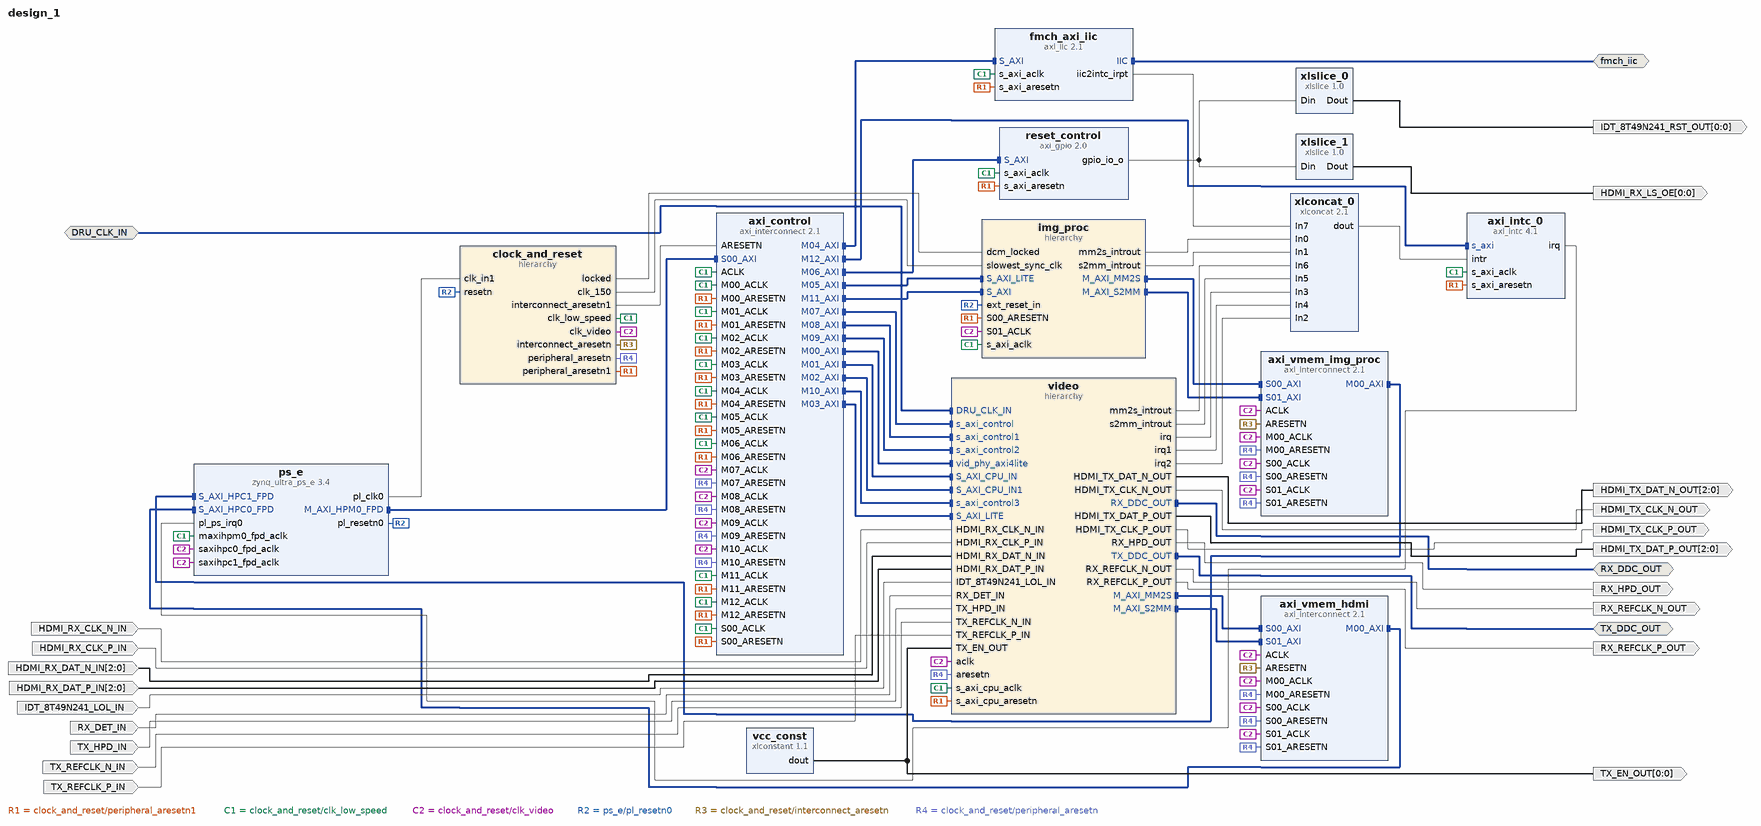
[diagram p0: block diagram of the top level]
# Vivado block design design_1, xczu7ev-ffvc1156-2-e, Vivado 2022.2
create_bd_design design_1

create_bd_intf_port -mode Slave -vlnv xilinx.com:interface:diff_clock_rtl:1.0 DRU_CLK_IN
set_property -dict {CONFIG.FREQ_HZ 156250000} [get_bd_intf_ports DRU_CLK_IN]
create_bd_intf_port -mode Master -vlnv xilinx.com:interface:iic_rtl:1.0 RX_DDC_OUT
create_bd_intf_port -mode Master -vlnv xilinx.com:interface:iic_rtl:1.0 TX_DDC_OUT
create_bd_intf_port -mode Master -vlnv xilinx.com:interface:iic_rtl:1.0 fmch_iic
create_bd_port -dir I HDMI_RX_CLK_N_IN
create_bd_port -dir I HDMI_RX_CLK_P_IN
create_bd_port -dir I -from 2 -to 0 HDMI_RX_DAT_N_IN
create_bd_port -dir I -from 2 -to 0 HDMI_RX_DAT_P_IN
create_bd_port -dir O -from 0 -to 0 HDMI_RX_LS_OE
create_bd_port -dir O HDMI_TX_CLK_N_OUT
create_bd_port -dir O HDMI_TX_CLK_P_OUT
create_bd_port -dir O -from 2 -to 0 HDMI_TX_DAT_N_OUT
create_bd_port -dir O -from 2 -to 0 HDMI_TX_DAT_P_OUT
create_bd_port -dir I IDT_8T49N241_LOL_IN
create_bd_port -dir O -from 0 -to 0 IDT_8T49N241_RST_OUT
create_bd_port -dir I RX_DET_IN
create_bd_port -dir O RX_HPD_OUT
create_bd_port -dir O RX_REFCLK_N_OUT
create_bd_port -dir O RX_REFCLK_P_OUT
create_bd_port -dir O -from 0 -to 0 TX_EN_OUT
create_bd_port -dir I TX_HPD_IN
create_bd_port -dir I TX_REFCLK_N_IN
create_bd_port -dir I TX_REFCLK_P_IN

create_bd_cell -type ip -vlnv xilinx.com:ip:axi_intc:4.1 axi_intc_0
set_property -dict [list \
  CONFIG.C_ASYNC_INTR 0xFFFFFFFF \
  CONFIG.C_CASCADE_MASTER 0 \
  CONFIG.C_DISABLE_SYNCHRONIZERS 0 \
  CONFIG.C_ENABLE_ASYNC 0 \
  CONFIG.C_EN_CASCADE_MODE 0 \
  CONFIG.C_HAS_CIE 1 \
  CONFIG.C_HAS_FAST 0 \
  CONFIG.C_HAS_ILR 0 \
  CONFIG.C_HAS_IPR 1 \
  CONFIG.C_HAS_IVR 1 \
  CONFIG.C_HAS_SIE 1 \
  CONFIG.C_IRQ_ACTIVE 0x1 \
  CONFIG.C_IRQ_CONNECTION 1 \
  CONFIG.C_IRQ_IS_LEVEL 1 \
  CONFIG.C_KIND_OF_EDGE 0xFFFFFFFF \
  CONFIG.C_KIND_OF_INTR 0xFFFFFFFF \
  CONFIG.C_KIND_OF_LVL 0xFFFFFFFF \
  CONFIG.C_MB_CLK_NOT_CONNECTED 1 \
  CONFIG.C_NUM_SW_INTR 0 \
  CONFIG.C_NUM_SYNC_FF 2 \
  CONFIG.C_PROCESSOR_CLK_FREQ_MHZ 100.0 \
  CONFIG.C_S_AXI_ACLK_FREQ_MHZ 75.0 \
  CONFIG.Sense_of_IRQ_Edge_Type Rising \
  CONFIG.Sense_of_IRQ_Level_Type Active_High \
] [get_bd_cells axi_intc_0]
create_bd_cell -type ip -vlnv xilinx.com:ip:zynq_ultra_ps_e:3.4 ps_e
set_property -dict [list \
  CONFIG.CAN0_BOARD_INTERFACE custom \
  CONFIG.CAN1_BOARD_INTERFACE custom \
  CONFIG.CSU_BOARD_INTERFACE custom \
  CONFIG.DP_BOARD_INTERFACE custom \
  CONFIG.GEM0_BOARD_INTERFACE custom \
  CONFIG.GEM1_BOARD_INTERFACE custom \
  CONFIG.GEM2_BOARD_INTERFACE custom \
  CONFIG.GEM3_BOARD_INTERFACE custom \
  CONFIG.GPIO_BOARD_INTERFACE custom \
  CONFIG.IIC0_BOARD_INTERFACE custom \
  CONFIG.IIC1_BOARD_INTERFACE custom \
  CONFIG.NAND_BOARD_INTERFACE custom \
  CONFIG.PCIE_BOARD_INTERFACE custom \
  CONFIG.PJTAG_BOARD_INTERFACE custom \
  CONFIG.PMU_BOARD_INTERFACE custom \
  CONFIG.PSU_BANK_0_IO_STANDARD LVCMOS18 \
  CONFIG.PSU_BANK_1_IO_STANDARD LVCMOS18 \
  CONFIG.PSU_BANK_2_IO_STANDARD LVCMOS18 \
  CONFIG.PSU_BANK_3_IO_STANDARD LVCMOS33 \
  CONFIG.PSU_USB3__DUAL_CLOCK_ENABLE 1 \
  CONFIG.PSU__CAN1__PERIPHERAL__ENABLE 1 \
  CONFIG.PSU__CAN1__PERIPHERAL__IO {MIO 24 .. 25} \
  CONFIG.PSU__CRF_APB__ACPU_CTRL__FREQMHZ 1200 \
  CONFIG.PSU__CRF_APB__ACPU_CTRL__SRCSEL APLL \
  CONFIG.PSU__CRF_APB__APLL_CTRL__SRCSEL PSS_REF_CLK \
  CONFIG.PSU__CRF_APB__DBG_FPD_CTRL__FREQMHZ 250 \
  CONFIG.PSU__CRF_APB__DBG_FPD_CTRL__SRCSEL IOPLL \
  CONFIG.PSU__CRF_APB__DBG_TRACE_CTRL__FREQMHZ 250 \
  CONFIG.PSU__CRF_APB__DBG_TRACE_CTRL__SRCSEL IOPLL \
  CONFIG.PSU__CRF_APB__DBG_TSTMP_CTRL__FREQMHZ 250 \
  CONFIG.PSU__CRF_APB__DBG_TSTMP_CTRL__SRCSEL IOPLL \
  CONFIG.PSU__CRF_APB__DDR_CTRL__FREQMHZ 1067 \
  CONFIG.PSU__CRF_APB__DDR_CTRL__SRCSEL DPLL \
  CONFIG.PSU__CRF_APB__DPDMA_REF_CTRL__FREQMHZ 600 \
  CONFIG.PSU__CRF_APB__DPDMA_REF_CTRL__SRCSEL APLL \
  CONFIG.PSU__CRF_APB__DPLL_CTRL__SRCSEL PSS_REF_CLK \
  CONFIG.PSU__CRF_APB__DP_AUDIO_REF_CTRL__SRCSEL RPLL \
  CONFIG.PSU__CRF_APB__DP_STC_REF_CTRL__SRCSEL RPLL \
  CONFIG.PSU__CRF_APB__DP_VIDEO_REF_CTRL__SRCSEL VPLL \
  CONFIG.PSU__CRF_APB__GDMA_REF_CTRL__FREQMHZ 600 \
  CONFIG.PSU__CRF_APB__GDMA_REF_CTRL__SRCSEL APLL \
  CONFIG.PSU__CRF_APB__GPU_REF_CTRL__FREQMHZ 500 \
  CONFIG.PSU__CRF_APB__GPU_REF_CTRL__SRCSEL IOPLL \
  CONFIG.PSU__CRF_APB__TOPSW_LSBUS_CTRL__FREQMHZ 100 \
  CONFIG.PSU__CRF_APB__TOPSW_LSBUS_CTRL__SRCSEL IOPLL \
  CONFIG.PSU__CRF_APB__TOPSW_MAIN_CTRL__FREQMHZ 533.33 \
  CONFIG.PSU__CRF_APB__TOPSW_MAIN_CTRL__SRCSEL DPLL \
  CONFIG.PSU__CRF_APB__VPLL_CTRL__SRCSEL PSS_REF_CLK \
  CONFIG.PSU__CRL_APB__ADMA_REF_CTRL__FREQMHZ 500 \
  CONFIG.PSU__CRL_APB__ADMA_REF_CTRL__SRCSEL IOPLL \
  CONFIG.PSU__CRL_APB__CAN1_REF_CTRL__FREQMHZ 100 \
  CONFIG.PSU__CRL_APB__CAN1_REF_CTRL__SRCSEL IOPLL \
  CONFIG.PSU__CRL_APB__CPU_R5_CTRL__FREQMHZ 500 \
  CONFIG.PSU__CRL_APB__CPU_R5_CTRL__SRCSEL IOPLL \
  CONFIG.PSU__CRL_APB__DBG_LPD_CTRL__FREQMHZ 250 \
  CONFIG.PSU__CRL_APB__DBG_LPD_CTRL__SRCSEL IOPLL \
  CONFIG.PSU__CRL_APB__GEM3_REF_CTRL__FREQMHZ 125 \
  CONFIG.PSU__CRL_APB__GEM3_REF_CTRL__SRCSEL IOPLL \
  CONFIG.PSU__CRL_APB__I2C0_REF_CTRL__FREQMHZ 100 \
  CONFIG.PSU__CRL_APB__I2C0_REF_CTRL__SRCSEL IOPLL \
  CONFIG.PSU__CRL_APB__I2C1_REF_CTRL__FREQMHZ 100 \
  CONFIG.PSU__CRL_APB__I2C1_REF_CTRL__SRCSEL IOPLL \
  CONFIG.PSU__CRL_APB__IOPLL_CTRL__SRCSEL PSS_REF_CLK \
  CONFIG.PSU__CRL_APB__IOU_SWITCH_CTRL__FREQMHZ 250 \
  CONFIG.PSU__CRL_APB__IOU_SWITCH_CTRL__SRCSEL IOPLL \
  CONFIG.PSU__CRL_APB__LPD_LSBUS_CTRL__FREQMHZ 100 \
  CONFIG.PSU__CRL_APB__LPD_LSBUS_CTRL__SRCSEL IOPLL \
  CONFIG.PSU__CRL_APB__LPD_SWITCH_CTRL__FREQMHZ 500 \
  CONFIG.PSU__CRL_APB__LPD_SWITCH_CTRL__SRCSEL IOPLL \
  CONFIG.PSU__CRL_APB__PCAP_CTRL__FREQMHZ 200 \
  CONFIG.PSU__CRL_APB__PCAP_CTRL__SRCSEL IOPLL \
  CONFIG.PSU__CRL_APB__PL0_REF_CTRL__FREQMHZ 100 \
  CONFIG.PSU__CRL_APB__PL0_REF_CTRL__SRCSEL IOPLL \
  CONFIG.PSU__CRL_APB__QSPI_REF_CTRL__FREQMHZ 125 \
  CONFIG.PSU__CRL_APB__QSPI_REF_CTRL__SRCSEL IOPLL \
  CONFIG.PSU__CRL_APB__RPLL_CTRL__SRCSEL PSS_REF_CLK \
  CONFIG.PSU__CRL_APB__SDIO1_REF_CTRL__FREQMHZ 200 \
  CONFIG.PSU__CRL_APB__SDIO1_REF_CTRL__SRCSEL IOPLL \
  CONFIG.PSU__CRL_APB__TIMESTAMP_REF_CTRL__FREQMHZ 100 \
  CONFIG.PSU__CRL_APB__TIMESTAMP_REF_CTRL__SRCSEL IOPLL \
  CONFIG.PSU__CRL_APB__UART0_REF_CTRL__FREQMHZ 100 \
  CONFIG.PSU__CRL_APB__UART0_REF_CTRL__SRCSEL IOPLL \
  CONFIG.PSU__CRL_APB__UART1_REF_CTRL__FREQMHZ 100 \
  CONFIG.PSU__CRL_APB__UART1_REF_CTRL__SRCSEL IOPLL \
  CONFIG.PSU__CRL_APB__USB0_BUS_REF_CTRL__FREQMHZ 250 \
  CONFIG.PSU__CRL_APB__USB0_BUS_REF_CTRL__SRCSEL IOPLL \
  CONFIG.PSU__CRL_APB__USB3_DUAL_REF_CTRL__FREQMHZ 20 \
  CONFIG.PSU__CRL_APB__USB3_DUAL_REF_CTRL__SRCSEL IOPLL \
  CONFIG.PSU__CRL_APB__USB3__ENABLE 1 \
  CONFIG.PSU__CSUPMU__PERIPHERAL__VALID 0 \
  CONFIG.PSU__DDRC__BUS_WIDTH {64 Bit} \
  CONFIG.PSU__DDRC__COMPONENTS Components \
  CONFIG.PSU__DDRC__DEVICE_CAPACITY {4096 MBits} \
  CONFIG.PSU__DDRC__DRAM_WIDTH {16 Bits} \
  CONFIG.PSU__DDRC__ECC Disabled \
  CONFIG.PSU__DDRC__MEMORY_TYPE {DDR 4} \
  CONFIG.PSU__DDRC__SPEED_BIN DDR4_2133P \
  CONFIG.PSU__DDR_HIGH_ADDRESS_GUI_ENABLE 0 \
  CONFIG.PSU__DDR__INTERFACE__FREQMHZ 533.500 \
  CONFIG.PSU__DEVICE_TYPE EV \
  CONFIG.PSU__DISPLAYPORT__LANE0__ENABLE 1 \
  CONFIG.PSU__DISPLAYPORT__LANE0__IO {GT Lane1} \
  CONFIG.PSU__DISPLAYPORT__LANE1__ENABLE 1 \
  CONFIG.PSU__DISPLAYPORT__LANE1__IO {GT Lane0} \
  CONFIG.PSU__DISPLAYPORT__PERIPHERAL__ENABLE 1 \
  CONFIG.PSU__DLL__ISUSED 1 \
  CONFIG.PSU__DPAUX__PERIPHERAL__ENABLE 1 \
  CONFIG.PSU__DPAUX__PERIPHERAL__IO {MIO 27 .. 30} \
  CONFIG.PSU__DP__LANE_SEL {Dual Lower} \
  CONFIG.PSU__DP__REF_CLK_FREQ 27 \
  CONFIG.PSU__DP__REF_CLK_SEL {Ref Clk3} \
  CONFIG.PSU__ENET3__FIFO__ENABLE 0 \
  CONFIG.PSU__ENET3__GRP_MDIO__ENABLE 1 \
  CONFIG.PSU__ENET3__GRP_MDIO__IO {MIO 76 .. 77} \
  CONFIG.PSU__ENET3__PERIPHERAL__ENABLE 1 \
  CONFIG.PSU__ENET3__PERIPHERAL__IO {MIO 64 .. 75} \
  CONFIG.PSU__ENET3__PTP__ENABLE 0 \
  CONFIG.PSU__ENET3__TSU__ENABLE 0 \
  CONFIG.PSU__FPGA_PL0_ENABLE 1 \
  CONFIG.PSU__GEM3_COHERENCY 0 \
  CONFIG.PSU__GEM3_ROUTE_THROUGH_FPD 0 \
  CONFIG.PSU__GEM__TSU__ENABLE 0 \
  CONFIG.PSU__GPIO0_MIO__PERIPHERAL__ENABLE 0 \
  CONFIG.PSU__GPIO1_MIO__PERIPHERAL__ENABLE 0 \
  CONFIG.PSU__GPIO_EMIO_WIDTH 95 \
  CONFIG.PSU__GT__LINK_SPEED HBR \
  CONFIG.PSU__GT__PRE_EMPH_LVL_4 0 \
  CONFIG.PSU__GT__VLT_SWNG_LVL_4 0 \
  CONFIG.PSU__I2C0__PERIPHERAL__ENABLE 0 \
  CONFIG.PSU__I2C1__PERIPHERAL__ENABLE 1 \
  CONFIG.PSU__I2C1__PERIPHERAL__IO {MIO 16 .. 17} \
  CONFIG.PSU__IOU_SLCR__IOU_TTC_APB_CLK__TTC0_SEL APB \
  CONFIG.PSU__IOU_SLCR__IOU_TTC_APB_CLK__TTC1_SEL APB \
  CONFIG.PSU__IOU_SLCR__IOU_TTC_APB_CLK__TTC2_SEL APB \
  CONFIG.PSU__IOU_SLCR__IOU_TTC_APB_CLK__TTC3_SEL APB \
  CONFIG.PSU__LPD_SLCR__CSUPMU__FREQMHZ 100 \
  CONFIG.PSU__MAXIGP0__DATA_WIDTH 32 \
  CONFIG.PSU__OVERRIDE_HPX_QOS 0 \
  CONFIG.PSU__OVERRIDE__BASIC_CLOCK 0 \
  CONFIG.PSU__PMU__GPO3__POLARITY {<Select>} \
  CONFIG.PSU__PMU__PERIPHERAL__ENABLE 0 \
  CONFIG.PSU__PRESET_APPLIED 1 \
  CONFIG.PSU__PSS_REF_CLK__FREQMHZ 33.333333 \
  CONFIG.PSU__QSPI_COHERENCY 0 \
  CONFIG.PSU__QSPI_ROUTE_THROUGH_FPD 0 \
  CONFIG.PSU__QSPI__GRP_FBCLK__ENABLE 1 \
  CONFIG.PSU__QSPI__GRP_FBCLK__IO {MIO 6} \
  CONFIG.PSU__QSPI__PERIPHERAL__DATA_MODE x4 \
  CONFIG.PSU__QSPI__PERIPHERAL__ENABLE 1 \
  CONFIG.PSU__QSPI__PERIPHERAL__IO {MIO 0 .. 5} \
  CONFIG.PSU__QSPI__PERIPHERAL__MODE Single \
  CONFIG.PSU__SATA__LANE1__IO {GT Lane3} \
  CONFIG.PSU__SATA__PERIPHERAL__ENABLE 1 \
  CONFIG.PSU__SATA__REF_CLK_FREQ 125 \
  CONFIG.PSU__SATA__REF_CLK_SEL {Ref Clk1} \
  CONFIG.PSU__SD0__CLK_100_SDR_OTAP_DLY 0x00 \
  CONFIG.PSU__SD0__CLK_200_SDR_OTAP_DLY 0x00 \
  CONFIG.PSU__SD0__CLK_50_DDR_ITAP_DLY 0x00 \
  CONFIG.PSU__SD0__CLK_50_DDR_OTAP_DLY 0x00 \
  CONFIG.PSU__SD0__CLK_50_SDR_ITAP_DLY 0x00 \
  CONFIG.PSU__SD0__CLK_50_SDR_OTAP_DLY 0x00 \
  CONFIG.PSU__SD1_COHERENCY 0 \
  CONFIG.PSU__SD1_ROUTE_THROUGH_FPD 0 \
  CONFIG.PSU__SD1__CLK_50_SDR_ITAP_DLY 0x15 \
  CONFIG.PSU__SD1__CLK_50_SDR_OTAP_DLY 0x5 \
  CONFIG.PSU__SD1__DATA_TRANSFER_MODE 4Bit \
  CONFIG.PSU__SD1__GRP_CD__ENABLE 1 \
  CONFIG.PSU__SD1__GRP_CD__IO {MIO 45} \
  CONFIG.PSU__SD1__GRP_POW__ENABLE 0 \
  CONFIG.PSU__SD1__GRP_WP__ENABLE 0 \
  CONFIG.PSU__SD1__PERIPHERAL__ENABLE 1 \
  CONFIG.PSU__SD1__PERIPHERAL__IO {MIO 46 .. 51} \
  CONFIG.PSU__SD1__SLOT_TYPE {SD 2.0} \
  CONFIG.PSU__SWDT0__CLOCK__ENABLE 0 \
  CONFIG.PSU__SWDT0__PERIPHERAL__ENABLE 1 \
  CONFIG.PSU__SWDT0__RESET__ENABLE 0 \
  CONFIG.PSU__SWDT1__CLOCK__ENABLE 0 \
  CONFIG.PSU__SWDT1__PERIPHERAL__ENABLE 1 \
  CONFIG.PSU__SWDT1__RESET__ENABLE 0 \
  CONFIG.PSU__TSU__BUFG_PORT_PAIR 0 \
  CONFIG.PSU__TTC0__CLOCK__ENABLE 0 \
  CONFIG.PSU__TTC0__PERIPHERAL__ENABLE 1 \
  CONFIG.PSU__TTC0__WAVEOUT__ENABLE 0 \
  CONFIG.PSU__TTC1__CLOCK__ENABLE 0 \
  CONFIG.PSU__TTC1__PERIPHERAL__ENABLE 1 \
  CONFIG.PSU__TTC1__WAVEOUT__ENABLE 0 \
  CONFIG.PSU__TTC2__CLOCK__ENABLE 0 \
  CONFIG.PSU__TTC2__PERIPHERAL__ENABLE 1 \
  CONFIG.PSU__TTC2__WAVEOUT__ENABLE 0 \
  CONFIG.PSU__TTC3__CLOCK__ENABLE 0 \
  CONFIG.PSU__TTC3__PERIPHERAL__ENABLE 1 \
  CONFIG.PSU__TTC3__WAVEOUT__ENABLE 0 \
  CONFIG.PSU__UART0__BAUD_RATE 115200 \
  CONFIG.PSU__UART0__MODEM__ENABLE 0 \
  CONFIG.PSU__UART0__PERIPHERAL__ENABLE 1 \
  CONFIG.PSU__UART0__PERIPHERAL__IO {MIO 18 .. 19} \
  CONFIG.PSU__UART1__BAUD_RATE 115200 \
  CONFIG.PSU__UART1__MODEM__ENABLE 0 \
  CONFIG.PSU__UART1__PERIPHERAL__ENABLE 1 \
  CONFIG.PSU__UART1__PERIPHERAL__IO {MIO 20 .. 21} \
  CONFIG.PSU__USB0_COHERENCY 0 \
  CONFIG.PSU__USB0__PERIPHERAL__ENABLE 1 \
  CONFIG.PSU__USB0__PERIPHERAL__IO {MIO 52 .. 63} \
  CONFIG.PSU__USB0__REF_CLK_FREQ 26 \
  CONFIG.PSU__USB0__REF_CLK_SEL {Ref Clk2} \
  CONFIG.PSU__USB2_0__EMIO__ENABLE 0 \
  CONFIG.PSU__USB3_0__EMIO__ENABLE 0 \
  CONFIG.PSU__USB3_0__PERIPHERAL__ENABLE 1 \
  CONFIG.PSU__USB3_0__PERIPHERAL__IO {GT Lane2} \
  CONFIG.PSU__USB__RESET__MODE {Boot Pin} \
  CONFIG.PSU__USB__RESET__POLARITY {Active Low} \
  CONFIG.PSU__USE__IRQ0 1 \
  CONFIG.PSU__USE__M_AXI_GP0 1 \
  CONFIG.PSU__USE__M_AXI_GP1 0 \
  CONFIG.PSU__USE__M_AXI_GP2 0 \
  CONFIG.PSU__USE__S_AXI_GP0 1 \
  CONFIG.PSU__USE__S_AXI_GP1 1 \
  CONFIG.QSPI_BOARD_INTERFACE custom \
  CONFIG.SATA_BOARD_INTERFACE custom \
  CONFIG.SD0_BOARD_INTERFACE custom \
  CONFIG.SD1_BOARD_INTERFACE custom \
  CONFIG.SPI0_BOARD_INTERFACE custom \
  CONFIG.SPI1_BOARD_INTERFACE custom \
  CONFIG.SUBPRESET1 Custom \
  CONFIG.SUBPRESET2 Custom \
  CONFIG.SWDT0_BOARD_INTERFACE custom \
  CONFIG.SWDT1_BOARD_INTERFACE custom \
  CONFIG.TRACE_BOARD_INTERFACE custom \
  CONFIG.TTC0_BOARD_INTERFACE custom \
  CONFIG.TTC1_BOARD_INTERFACE custom \
  CONFIG.TTC2_BOARD_INTERFACE custom \
  CONFIG.TTC3_BOARD_INTERFACE custom \
  CONFIG.UART0_BOARD_INTERFACE custom \
  CONFIG.UART1_BOARD_INTERFACE custom \
  CONFIG.USB0_BOARD_INTERFACE custom \
  CONFIG.USB1_BOARD_INTERFACE custom \
  CONFIG.preset None \
] [get_bd_cells ps_e]
# 789 more settings of ps_e are not shown: defaults, MIO pin electricals, DDR timing, and values the tool derives
create_bd_cell -type ip -vlnv xilinx.com:ip:xlconcat:2.1 xlconcat_0
set_property -dict {CONFIG.NUM_PORTS 8} [get_bd_cells xlconcat_0]
create_bd_cell -type hier img_proc
create_bd_cell -type ip -vlnv xilinx.com:ip:axi_interconnect:2.1 axi_control
set_property -dict {CONFIG.NUM_MI 13} [get_bd_cells axi_control]
create_bd_cell -type ip -vlnv xilinx.com:ip:axi_iic:2.1 fmch_axi_iic
set_property -dict [list \
  CONFIG.C_SCL_INERTIAL_DELAY 10 \
  CONFIG.C_SDA_INERTIAL_DELAY 10 \
  CONFIG.IIC_BOARD_INTERFACE Custom \
  CONFIG.USE_BOARD_FLOW true \
] [get_bd_cells fmch_axi_iic]
create_bd_cell -type ip -vlnv xilinx.com:ip:axi_gpio:2.0 reset_control
set_property -dict {CONFIG.C_ALL_OUTPUTS 1} [get_bd_cells reset_control]
create_bd_cell -type ip -vlnv xilinx.com:ip:xlconstant:1.1 vcc_const
set_property -dict {CONFIG.CONST_VAL 1} [get_bd_cells vcc_const]
create_bd_cell -type hier video
create_bd_cell -type ip -vlnv xilinx.com:ip:xlslice:1.0 xlslice_0
create_bd_cell -type ip -vlnv xilinx.com:ip:xlslice:1.0 xlslice_1
set_property -dict {CONFIG.DIN_FROM 1 CONFIG.DIN_TO 1 CONFIG.DOUT_WIDTH 1} [get_bd_cells xlslice_1]
create_bd_cell -type ip -vlnv xilinx.com:ip:axi_interconnect:2.1 axi_vmem_img_proc
set_property -dict {CONFIG.NUM_MI 1 CONFIG.NUM_SI 2} [get_bd_cells axi_vmem_img_proc]
create_bd_cell -type ip -vlnv xilinx.com:ip:axi_interconnect:2.1 axi_vmem_hdmi
set_property -dict {CONFIG.NUM_MI 1 CONFIG.NUM_SI 2} [get_bd_cells axi_vmem_hdmi]
create_bd_cell -type hier clock_and_reset

# ---- hierarchy /img_proc ----
current_bd_instance /img_proc
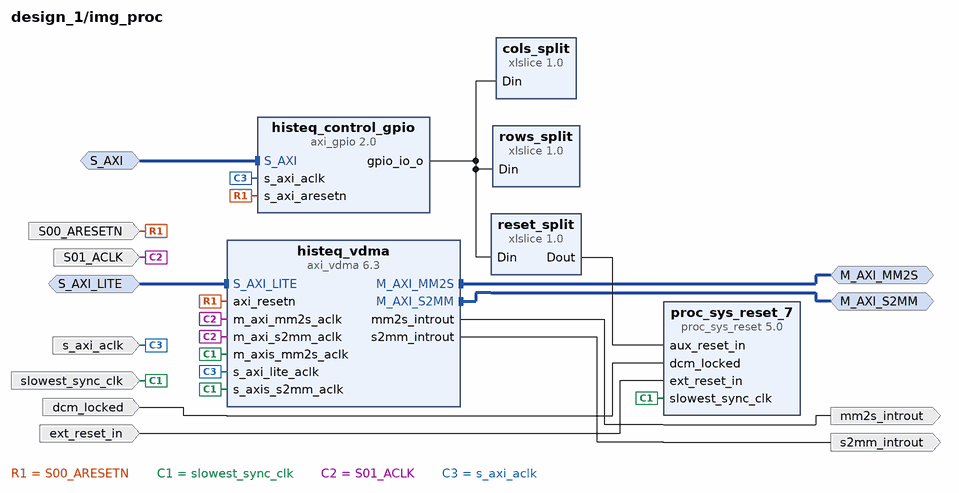
[diagram p1: block diagram inside /img_proc]
create_bd_intf_pin -mode Slave -vlnv xilinx.com:interface:aximm_rtl:1.0 S_AXI_LITE
create_bd_intf_pin -mode Slave -vlnv xilinx.com:interface:aximm_rtl:1.0 S_AXI
create_bd_intf_pin -mode Master -vlnv xilinx.com:interface:aximm_rtl:1.0 M_AXI_MM2S
create_bd_intf_pin -mode Master -vlnv xilinx.com:interface:aximm_rtl:1.0 M_AXI_S2MM
create_bd_pin -dir I -type clk S01_ACLK
create_bd_pin -dir I -type clk s_axi_aclk
create_bd_pin -dir I -type rst S00_ARESETN
create_bd_pin -dir I -type rst ext_reset_in
create_bd_pin -dir O -type intr mm2s_introut
create_bd_pin -dir O -type intr s2mm_introut
create_bd_pin -dir I dcm_locked
create_bd_pin -dir I -type clk slowest_sync_clk

create_bd_cell -type ip -vlnv xilinx.com:ip:xlslice:1.0 reset_split
set_property -dict {CONFIG.DIN_FROM 24 CONFIG.DIN_TO 24 CONFIG.DIN_WIDTH 25} [get_bd_cells reset_split]
create_bd_cell -type ip -vlnv xilinx.com:ip:xlslice:1.0 cols_split
set_property -dict {CONFIG.DIN_FROM 23 CONFIG.DIN_TO 12 CONFIG.DIN_WIDTH 25 CONFIG.DOUT_WIDTH 12} [get_bd_cells cols_split]
create_bd_cell -type ip -vlnv xilinx.com:ip:xlslice:1.0 rows_split
set_property -dict {CONFIG.DIN_FROM 11 CONFIG.DIN_WIDTH 25} [get_bd_cells rows_split]
create_bd_cell -type ip -vlnv xilinx.com:ip:proc_sys_reset:5.0 proc_sys_reset_7
set_property -dict {CONFIG.C_AUX_RESET_HIGH 1 CONFIG.C_AUX_RST_WIDTH 1 CONFIG.C_EXT_RST_WIDTH 1} [get_bd_cells proc_sys_reset_7]
create_bd_cell -type ip -vlnv xilinx.com:ip:axi_vdma:6.3 histeq_vdma
set_property -dict [list \
  CONFIG.c_m_axi_mm2s_data_width 128 \
  CONFIG.c_m_axi_s2mm_data_width 128 \
  CONFIG.c_m_axis_mm2s_tdata_width 24 \
  CONFIG.c_mm2s_linebuffer_depth 4096 \
  CONFIG.c_mm2s_max_burst_length 256 \
  CONFIG.c_num_fstores 4 \
  CONFIG.c_s2mm_linebuffer_depth 4096 \
  CONFIG.c_s2mm_max_burst_length 256 \
] [get_bd_cells histeq_vdma]
create_bd_cell -type ip -vlnv xilinx.com:ip:axi_gpio:2.0 histeq_control_gpio
set_property -dict {CONFIG.C_ALL_OUTPUTS 1 CONFIG.C_GPIO_WIDTH 25} [get_bd_cells histeq_control_gpio]

# ---- hierarchy /video ----
current_bd_instance /video
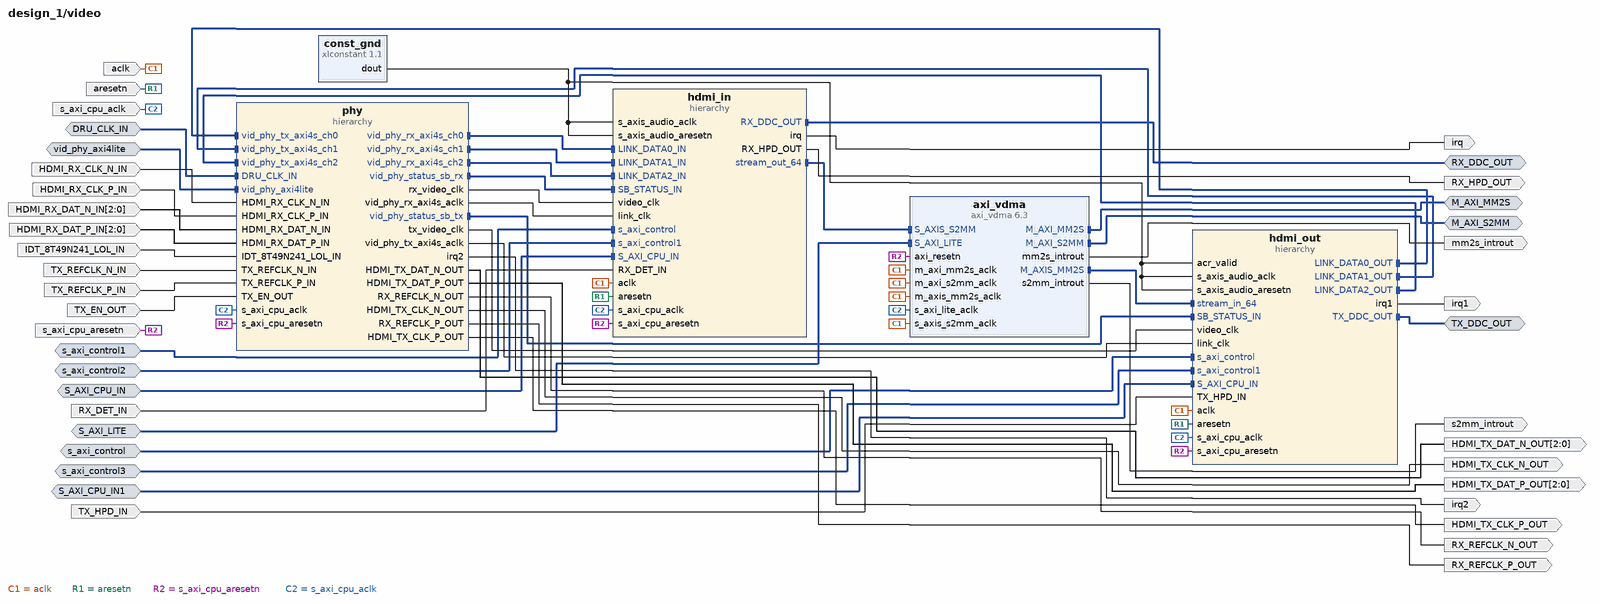
[diagram p2: block diagram inside /video]
create_bd_intf_pin -mode Slave -vlnv xilinx.com:interface:diff_clock_rtl:1.0 DRU_CLK_IN
create_bd_intf_pin -mode Master -vlnv xilinx.com:interface:aximm_rtl:1.0 M_AXI_MM2S
create_bd_intf_pin -mode Master -vlnv xilinx.com:interface:aximm_rtl:1.0 M_AXI_S2MM
create_bd_intf_pin -mode Master -vlnv xilinx.com:interface:iic_rtl:1.0 RX_DDC_OUT
create_bd_intf_pin -mode Slave -vlnv xilinx.com:interface:aximm_rtl:1.0 S_AXI_CPU_IN
create_bd_intf_pin -mode Slave -vlnv xilinx.com:interface:aximm_rtl:1.0 S_AXI_CPU_IN1
create_bd_intf_pin -mode Slave -vlnv xilinx.com:interface:aximm_rtl:1.0 S_AXI_LITE
create_bd_intf_pin -mode Master -vlnv xilinx.com:interface:iic_rtl:1.0 TX_DDC_OUT
create_bd_intf_pin -mode Slave -vlnv xilinx.com:interface:aximm_rtl:1.0 s_axi_control
create_bd_intf_pin -mode Slave -vlnv xilinx.com:interface:aximm_rtl:1.0 s_axi_control1
create_bd_intf_pin -mode Slave -vlnv xilinx.com:interface:aximm_rtl:1.0 s_axi_control2
create_bd_intf_pin -mode Slave -vlnv xilinx.com:interface:aximm_rtl:1.0 s_axi_control3
create_bd_intf_pin -mode Slave -vlnv xilinx.com:interface:aximm_rtl:1.0 vid_phy_axi4lite
create_bd_pin -dir I -type clk HDMI_RX_CLK_N_IN
create_bd_pin -dir I -type clk HDMI_RX_CLK_P_IN
create_bd_pin -dir I -from 2 -to 0 HDMI_RX_DAT_N_IN
create_bd_pin -dir I -from 2 -to 0 HDMI_RX_DAT_P_IN
create_bd_pin -dir O -type clk HDMI_TX_CLK_N_OUT
create_bd_pin -dir O -type clk HDMI_TX_CLK_P_OUT
create_bd_pin -dir O -from 2 -to 0 HDMI_TX_DAT_N_OUT
create_bd_pin -dir O -from 2 -to 0 HDMI_TX_DAT_P_OUT
create_bd_pin -dir I IDT_8T49N241_LOL_IN
create_bd_pin -dir I RX_DET_IN
create_bd_pin -dir O RX_HPD_OUT
create_bd_pin -dir O -type clk RX_REFCLK_N_OUT
create_bd_pin -dir O -type clk RX_REFCLK_P_OUT
create_bd_pin -dir I -type rst TX_EN_OUT
create_bd_pin -dir I TX_HPD_IN
create_bd_pin -dir I -type clk TX_REFCLK_N_IN
create_bd_pin -dir I -type clk TX_REFCLK_P_IN
create_bd_pin -dir I -type clk aclk
create_bd_pin -dir I -type rst aresetn
create_bd_pin -dir O -type intr irq
create_bd_pin -dir O -type intr irq1
create_bd_pin -dir O -type intr irq2
create_bd_pin -dir O -type intr mm2s_introut
create_bd_pin -dir O -type intr s2mm_introut
create_bd_pin -dir I -type clk s_axi_cpu_aclk
create_bd_pin -dir I -type rst s_axi_cpu_aresetn

create_bd_cell -type ip -vlnv xilinx.com:ip:axi_vdma:6.3 axi_vdma
set_property -dict [list \
  CONFIG.c_m_axi_mm2s_data_width 128 \
  CONFIG.c_m_axi_s2mm_data_width 128 \
  CONFIG.c_m_axis_mm2s_tdata_width 64 \
  CONFIG.c_mm2s_linebuffer_depth 4096 \
  CONFIG.c_mm2s_max_burst_length 256 \
  CONFIG.c_num_fstores 4 \
  CONFIG.c_s2mm_linebuffer_depth 4096 \
  CONFIG.c_s2mm_max_burst_length 256 \
] [get_bd_cells axi_vdma]
create_bd_cell -type ip -vlnv xilinx.com:ip:xlconstant:1.1 const_gnd
set_property -dict {CONFIG.CONST_VAL 0} [get_bd_cells const_gnd]
create_bd_cell -type hier hdmi_in
create_bd_cell -type hier hdmi_out
create_bd_cell -type hier phy

# ---- hierarchy /video/hdmi_in ----
current_bd_instance /video/hdmi_in
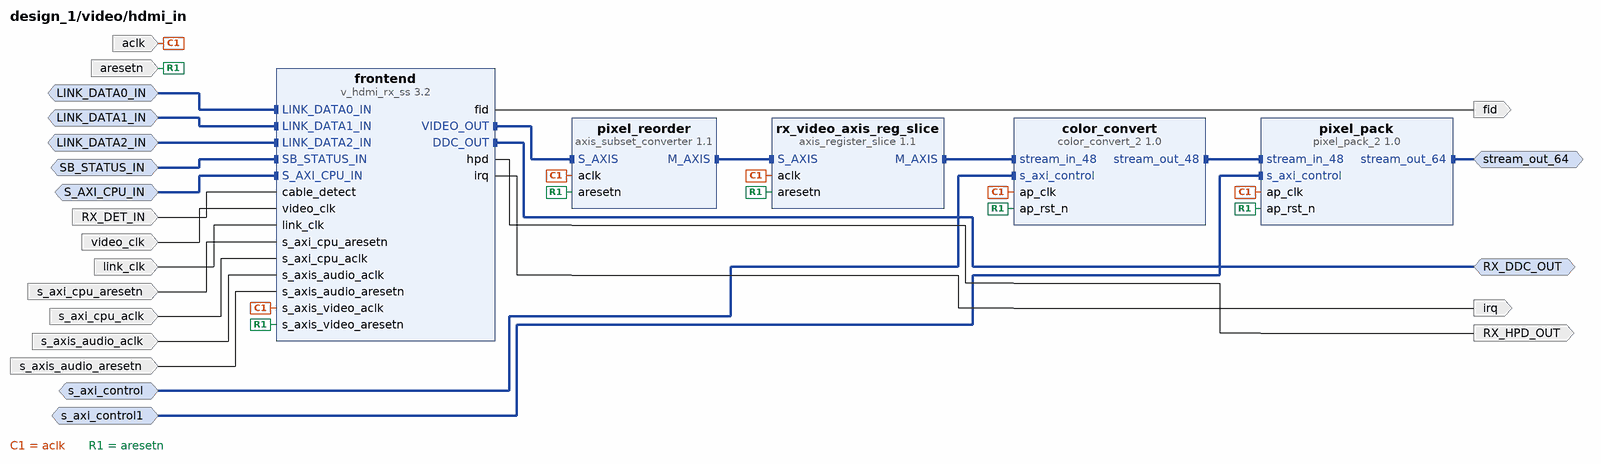
[diagram p3: block diagram inside /video/hdmi_in]
create_bd_intf_pin -mode Slave -vlnv xilinx.com:interface:axis_rtl:1.0 LINK_DATA0_IN
create_bd_intf_pin -mode Slave -vlnv xilinx.com:interface:axis_rtl:1.0 LINK_DATA1_IN
create_bd_intf_pin -mode Slave -vlnv xilinx.com:interface:axis_rtl:1.0 LINK_DATA2_IN
create_bd_intf_pin -mode Master -vlnv xilinx.com:interface:iic_rtl:1.0 RX_DDC_OUT
create_bd_intf_pin -mode Slave -vlnv xilinx.com:interface:axis_rtl:1.0 SB_STATUS_IN
create_bd_intf_pin -mode Slave -vlnv xilinx.com:interface:aximm_rtl:1.0 S_AXI_CPU_IN
create_bd_intf_pin -mode Slave -vlnv xilinx.com:interface:aximm_rtl:1.0 s_axi_control
create_bd_intf_pin -mode Slave -vlnv xilinx.com:interface:aximm_rtl:1.0 s_axi_control1
create_bd_intf_pin -mode Master -vlnv xilinx.com:interface:axis_rtl:1.0 stream_out_64
create_bd_pin -dir I RX_DET_IN
create_bd_pin -dir O RX_HPD_OUT
create_bd_pin -dir I -type clk aclk
create_bd_pin -dir I -type rst aresetn
create_bd_pin -dir O fid
create_bd_pin -dir O -type intr irq
create_bd_pin -dir I -type clk link_clk
create_bd_pin -dir I -type clk s_axi_cpu_aclk
create_bd_pin -dir I -type rst s_axi_cpu_aresetn
create_bd_pin -dir I -type clk s_axis_audio_aclk
create_bd_pin -dir I -type rst s_axis_audio_aresetn
create_bd_pin -dir I -type clk video_clk

create_bd_cell -type ip -vlnv xilinx.com:hls:color_convert_2:1.0 color_convert
create_bd_cell -type ip -vlnv xilinx.com:ip:v_hdmi_rx_ss:3.2 frontend
set_property -dict [list \
  CONFIG.C_ADDR_WIDTH 10 \
  CONFIG.C_ADD_MARK_DBG 0 \
  CONFIG.C_CD_INVERT true \
  CONFIG.C_EDID_RAM_SIZE 256 \
  CONFIG.C_HDMI_FAST_SWITCH true \
  CONFIG.C_HDMI_VERSION 3 \
  CONFIG.C_HPD_INVERT false \
  CONFIG.C_INCLUDE_HDCP_1_4 false \
  CONFIG.C_INCLUDE_HDCP_2_2 false \
  CONFIG.C_INCLUDE_LOW_RESO_VID false \
  CONFIG.C_INCLUDE_YUV420_SUP false \
  CONFIG.C_INPUT_PIXELS_PER_CLOCK 2 \
  CONFIG.C_MAX_BITS_PER_COMPONENT 8 \
  CONFIG.C_VALIDATION_ENABLE false \
  CONFIG.C_VID_INTERFACE 0 \
] [get_bd_cells frontend]
create_bd_cell -type ip -vlnv xilinx.com:hls:pixel_pack_2:1.0 pixel_pack
create_bd_cell -type ip -vlnv xilinx.com:ip:axis_subset_converter:1.1 pixel_reorder
set_property -dict [list \
  CONFIG.M_HAS_TKEEP 0 \
  CONFIG.M_HAS_TLAST 1 \
  CONFIG.M_HAS_TREADY 1 \
  CONFIG.M_HAS_TSTRB 0 \
  CONFIG.M_TDATA_NUM_BYTES 6 \
  CONFIG.M_TDEST_WIDTH 0 \
  CONFIG.M_TID_WIDTH 0 \
  CONFIG.M_TUSER_WIDTH 1 \
  CONFIG.S_HAS_TKEEP 0 \
  CONFIG.S_HAS_TLAST 1 \
  CONFIG.S_HAS_TREADY 1 \
  CONFIG.S_HAS_TSTRB 0 \
  CONFIG.S_TDATA_NUM_BYTES 6 \
  CONFIG.S_TDEST_WIDTH 0 \
  CONFIG.S_TID_WIDTH 0 \
  CONFIG.S_TUSER_WIDTH 1 \
  CONFIG.TDATA_REMAP {tdata[47:40],tdata[31:24],tdata[39:32],tdata[23:16],tdata[7:0],tdata[15:8]} \
  CONFIG.TLAST_REMAP {tlast[0]} \
  CONFIG.TUSER_REMAP {tuser[0:0]} \
] [get_bd_cells pixel_reorder]
create_bd_cell -type ip -vlnv xilinx.com:ip:axis_register_slice:1.1 rx_video_axis_reg_slice

# ---- hierarchy /video/hdmi_out ----
current_bd_instance /video/hdmi_out
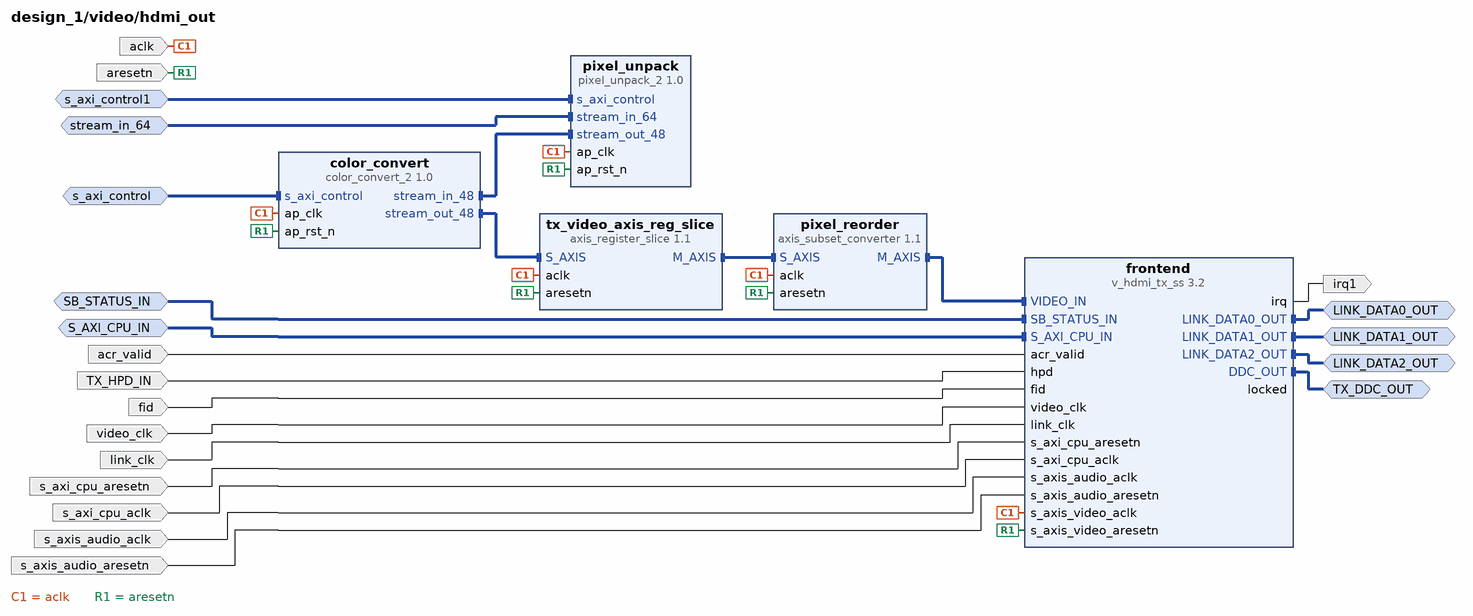
[diagram p4: block diagram inside /video/hdmi_out]
create_bd_intf_pin -mode Master -vlnv xilinx.com:interface:axis_rtl:1.0 LINK_DATA0_OUT
create_bd_intf_pin -mode Master -vlnv xilinx.com:interface:axis_rtl:1.0 LINK_DATA1_OUT
create_bd_intf_pin -mode Master -vlnv xilinx.com:interface:axis_rtl:1.0 LINK_DATA2_OUT
create_bd_intf_pin -mode Slave -vlnv xilinx.com:interface:axis_rtl:1.0 SB_STATUS_IN
create_bd_intf_pin -mode Slave -vlnv xilinx.com:interface:aximm_rtl:1.0 S_AXI_CPU_IN
create_bd_intf_pin -mode Master -vlnv xilinx.com:interface:iic_rtl:1.0 TX_DDC_OUT
create_bd_intf_pin -mode Slave -vlnv xilinx.com:interface:aximm_rtl:1.0 s_axi_control
create_bd_intf_pin -mode Slave -vlnv xilinx.com:interface:aximm_rtl:1.0 s_axi_control1
create_bd_intf_pin -mode Slave -vlnv xilinx.com:interface:axis_rtl:1.0 stream_in_64
create_bd_pin -dir I TX_HPD_IN
create_bd_pin -dir I -type clk aclk
create_bd_pin -dir I acr_valid
create_bd_pin -dir I -type rst aresetn
create_bd_pin -dir I fid
create_bd_pin -dir O -type intr irq1
create_bd_pin -dir I -type clk link_clk
create_bd_pin -dir I -type clk s_axi_cpu_aclk
create_bd_pin -dir I -type rst s_axi_cpu_aresetn
create_bd_pin -dir I -type clk s_axis_audio_aclk
create_bd_pin -dir I -type rst s_axis_audio_aresetn
create_bd_pin -dir I -type clk video_clk

create_bd_cell -type ip -vlnv xilinx.com:hls:color_convert_2:1.0 color_convert
create_bd_cell -type ip -vlnv xilinx.com:ip:v_hdmi_tx_ss:3.2 frontend
set_property -dict [list \
  CONFIG.C_ADDR_WIDTH 13 \
  CONFIG.C_ADD_MARK_DBG 0 \
  CONFIG.C_EXDES_AXILITE_FREQ 100 \
  CONFIG.C_EXDES_NIDRU true \
  CONFIG.C_EXDES_RX_PLL_SELECTION 0 \
  CONFIG.C_EXDES_TOPOLOGY 0 \
  CONFIG.C_EXDES_TX_PLL_SELECTION 6 \
  CONFIG.C_HDMI_FAST_SWITCH true \
  CONFIG.C_HDMI_VERSION 3 \
  CONFIG.C_HPD_INVERT false \
  CONFIG.C_HYSTERESIS_LEVEL 12 \
  CONFIG.C_INCLUDE_HDCP_1_4 false \
  CONFIG.C_INCLUDE_HDCP_2_2 false \
  CONFIG.C_INCLUDE_LOW_RESO_VID false \
  CONFIG.C_INCLUDE_YUV420_SUP false \
  CONFIG.C_INPUT_PIXELS_PER_CLOCK 2 \
  CONFIG.C_MAX_BITS_PER_COMPONENT 8 \
  CONFIG.C_VALIDATION_ENABLE false \
  CONFIG.C_VIDEO_MASK_ENABLE 1 \
  CONFIG.C_VID_INTERFACE 0 \
] [get_bd_cells frontend]
create_bd_cell -type ip -vlnv xilinx.com:ip:axis_subset_converter:1.1 pixel_reorder
set_property -dict [list \
  CONFIG.M_HAS_TKEEP 1 \
  CONFIG.M_HAS_TLAST 1 \
  CONFIG.M_HAS_TREADY 1 \
  CONFIG.M_HAS_TSTRB 1 \
  CONFIG.M_TDATA_NUM_BYTES 6 \
  CONFIG.M_TDEST_WIDTH 0 \
  CONFIG.M_TID_WIDTH 0 \
  CONFIG.M_TUSER_WIDTH 1 \
  CONFIG.S_HAS_TKEEP 1 \
  CONFIG.S_HAS_TLAST 1 \
  CONFIG.S_HAS_TREADY 1 \
  CONFIG.S_HAS_TSTRB 1 \
  CONFIG.S_TDATA_NUM_BYTES 6 \
  CONFIG.S_TDEST_WIDTH 0 \
  CONFIG.S_TID_WIDTH 0 \
  CONFIG.S_TUSER_WIDTH 1 \
  CONFIG.TDATA_REMAP {tdata[47:40],tdata[31:24],tdata[39:32],tdata[23:16],tdata[7:0],tdata[15:8]} \
  CONFIG.TLAST_REMAP {tlast[0]} \
  CONFIG.TUSER_REMAP {tuser[0:0]} \
] [get_bd_cells pixel_reorder]
create_bd_cell -type ip -vlnv xilinx.com:hls:pixel_unpack_2:1.0 pixel_unpack
create_bd_cell -type ip -vlnv xilinx.com:ip:axis_register_slice:1.1 tx_video_axis_reg_slice

# ---- hierarchy /video/phy ----
current_bd_instance /video/phy
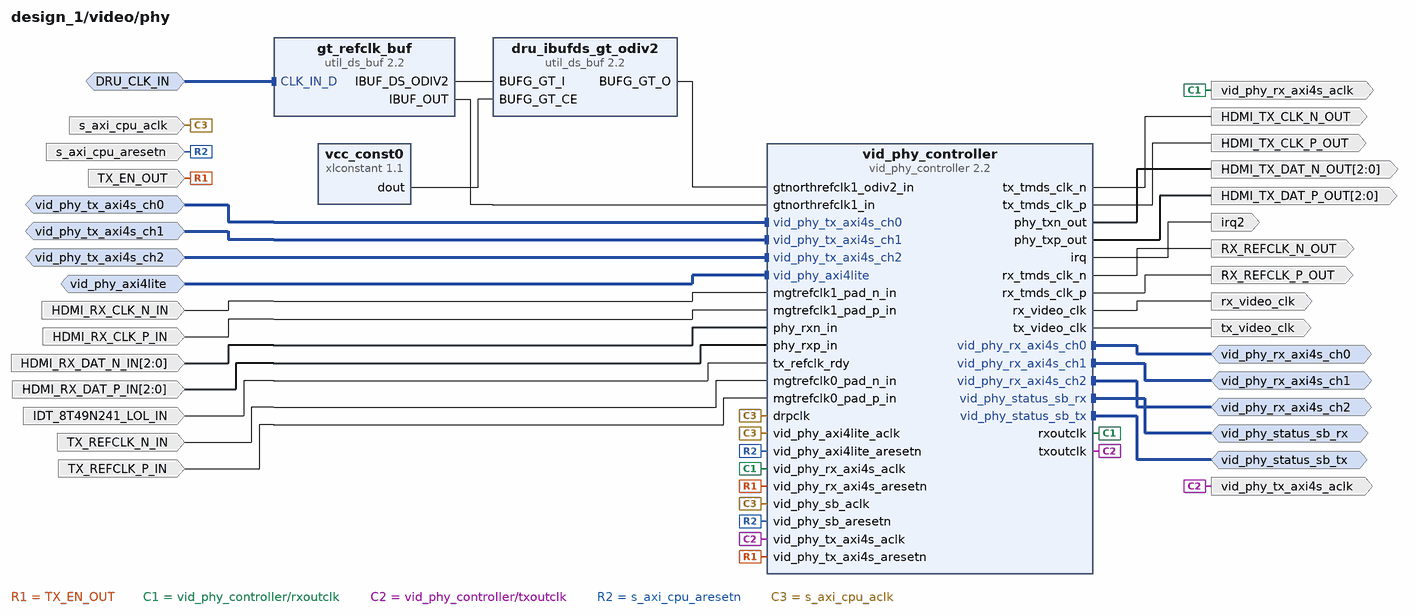
[diagram p5: block diagram inside /video/phy]
create_bd_intf_pin -mode Slave -vlnv xilinx.com:interface:diff_clock_rtl:1.0 DRU_CLK_IN
create_bd_intf_pin -mode Slave -vlnv xilinx.com:interface:aximm_rtl:1.0 vid_phy_axi4lite
create_bd_intf_pin -mode Master -vlnv xilinx.com:interface:axis_rtl:1.0 vid_phy_rx_axi4s_ch0
create_bd_intf_pin -mode Master -vlnv xilinx.com:interface:axis_rtl:1.0 vid_phy_rx_axi4s_ch1
create_bd_intf_pin -mode Master -vlnv xilinx.com:interface:axis_rtl:1.0 vid_phy_rx_axi4s_ch2
create_bd_intf_pin -mode Master -vlnv xilinx.com:interface:axis_rtl:1.0 vid_phy_status_sb_rx
create_bd_intf_pin -mode Master -vlnv xilinx.com:interface:axis_rtl:1.0 vid_phy_status_sb_tx
create_bd_intf_pin -mode Slave -vlnv xilinx.com:interface:axis_rtl:1.0 vid_phy_tx_axi4s_ch0
create_bd_intf_pin -mode Slave -vlnv xilinx.com:interface:axis_rtl:1.0 vid_phy_tx_axi4s_ch1
create_bd_intf_pin -mode Slave -vlnv xilinx.com:interface:axis_rtl:1.0 vid_phy_tx_axi4s_ch2
create_bd_pin -dir I -type clk HDMI_RX_CLK_N_IN
create_bd_pin -dir I -type clk HDMI_RX_CLK_P_IN
create_bd_pin -dir I -from 2 -to 0 HDMI_RX_DAT_N_IN
create_bd_pin -dir I -from 2 -to 0 HDMI_RX_DAT_P_IN
create_bd_pin -dir O -type clk HDMI_TX_CLK_N_OUT
create_bd_pin -dir O -type clk HDMI_TX_CLK_P_OUT
create_bd_pin -dir O -from 2 -to 0 HDMI_TX_DAT_N_OUT
create_bd_pin -dir O -from 2 -to 0 HDMI_TX_DAT_P_OUT
create_bd_pin -dir I IDT_8T49N241_LOL_IN
create_bd_pin -dir O -type clk RX_REFCLK_N_OUT
create_bd_pin -dir O -type clk RX_REFCLK_P_OUT
create_bd_pin -dir I -type rst TX_EN_OUT
create_bd_pin -dir I -type clk TX_REFCLK_N_IN
create_bd_pin -dir I -type clk TX_REFCLK_P_IN
create_bd_pin -dir O -type intr irq2
create_bd_pin -dir O -type clk rx_video_clk
create_bd_pin -dir I -type clk s_axi_cpu_aclk
create_bd_pin -dir I -type rst s_axi_cpu_aresetn
create_bd_pin -dir O -type clk tx_video_clk
create_bd_pin -dir O -type clk vid_phy_rx_axi4s_aclk
create_bd_pin -dir O -type clk vid_phy_tx_axi4s_aclk

create_bd_cell -type ip -vlnv xilinx.com:ip:util_ds_buf:2.2 dru_ibufds_gt_odiv2
set_property -dict {CONFIG.C_BUF_TYPE BUFG_GT} [get_bd_cells dru_ibufds_gt_odiv2]
create_bd_cell -type ip -vlnv xilinx.com:ip:util_ds_buf:2.2 gt_refclk_buf
set_property -dict {CONFIG.C_BUF_TYPE IBUFDSGTE} [get_bd_cells gt_refclk_buf]
create_bd_cell -type ip -vlnv xilinx.com:ip:xlconstant:1.1 vcc_const0
set_property -dict {CONFIG.CONST_VAL 1} [get_bd_cells vcc_const0]
create_bd_cell -type ip -vlnv xilinx.com:ip:vid_phy_controller:2.2 vid_phy_controller
set_property -dict [list \
  CONFIG.CHANNEL_ENABLE {X0Y16 X0Y17 X0Y18} \
  CONFIG.CHANNEL_SITE X0Y16 \
  CONFIG.C_INPUT_PIXELS_PER_CLOCK 2 \
  CONFIG.C_INT_HDMI_VER_CMPTBLE 3 \
  CONFIG.C_NIDRU true \
  CONFIG.C_NIDRU_REFCLK_SEL 3 \
  CONFIG.C_RX_PLL_SELECTION 0 \
  CONFIG.C_RX_REFCLK_SEL 1 \
  CONFIG.C_Rx_Protocol HDMI \
  CONFIG.C_TX_PLL_SELECTION 6 \
  CONFIG.C_TX_REFCLK_SEL 0 \
  CONFIG.C_Tx_Protocol HDMI \
  CONFIG.C_Txrefclk_Rdy_Invert true \
  CONFIG.C_Use_Oddr_for_Tmds_Clkout true \
  CONFIG.C_vid_phy_rx_axi4s_ch_INT_TDATA_WIDTH 20 \
  CONFIG.C_vid_phy_rx_axi4s_ch_TDATA_WIDTH 20 \
  CONFIG.C_vid_phy_rx_axi4s_ch_TUSER_WIDTH 1 \
  CONFIG.C_vid_phy_tx_axi4s_ch_INT_TDATA_WIDTH 20 \
  CONFIG.C_vid_phy_tx_axi4s_ch_TDATA_WIDTH 20 \
  CONFIG.C_vid_phy_tx_axi4s_ch_TUSER_WIDTH 1 \
  CONFIG.Rx_GT_Line_Rate 5.94 \
  CONFIG.Rx_GT_Ref_Clock_Freq 297 \
  CONFIG.Tx_GT_Line_Rate 5.94 \
  CONFIG.Tx_GT_Ref_Clock_Freq 297 \
] [get_bd_cells vid_phy_controller]

# ---- hierarchy /clock_and_reset ----
current_bd_instance /clock_and_reset
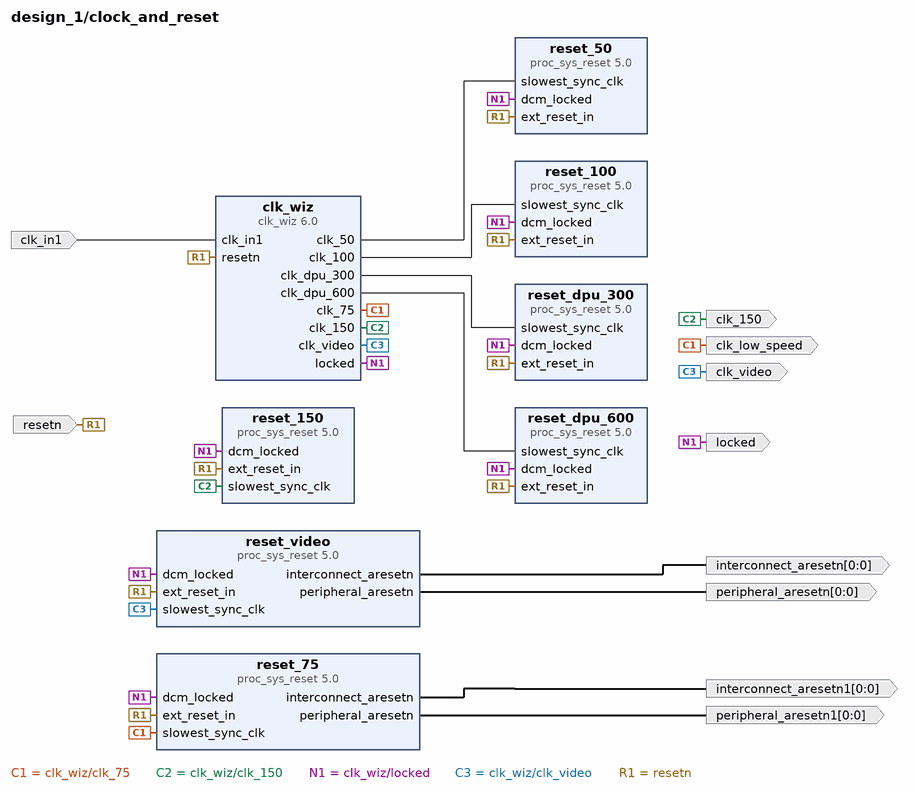
[diagram p6: block diagram inside /clock_and_reset]
create_bd_pin -dir I -type rst resetn
create_bd_pin -dir O locked
create_bd_pin -dir O -from 0 -to 0 -type rst interconnect_aresetn
create_bd_pin -dir O -from 0 -to 0 -type rst peripheral_aresetn
create_bd_pin -dir I -type clk clk_in1
create_bd_pin -dir O -type clk clk_low_speed
create_bd_pin -dir O -from 0 -to 0 -type rst interconnect_aresetn1
create_bd_pin -dir O -from 0 -to 0 -type rst peripheral_aresetn1
create_bd_pin -dir O -type clk clk_video
create_bd_pin -dir O -type clk clk_150

create_bd_cell -type ip -vlnv xilinx.com:ip:proc_sys_reset:5.0 reset_dpu_600
create_bd_cell -type ip -vlnv xilinx.com:ip:proc_sys_reset:5.0 reset_75
create_bd_cell -type ip -vlnv xilinx.com:ip:proc_sys_reset:5.0 reset_150
create_bd_cell -type ip -vlnv xilinx.com:ip:proc_sys_reset:5.0 reset_100
create_bd_cell -type ip -vlnv xilinx.com:ip:proc_sys_reset:5.0 reset_video
create_bd_cell -type ip -vlnv xilinx.com:ip:proc_sys_reset:5.0 reset_dpu_300
create_bd_cell -type ip -vlnv xilinx.com:ip:clk_wiz:6.0 clk_wiz
set_property -dict [list \
  CONFIG.AUTO_PRIMITIVE MMCM \
  CONFIG.AXI_DRP false \
  CONFIG.CALC_DONE empty \
  CONFIG.CDDCDONE_PORT cddcdone \
  CONFIG.CDDCREQ_PORT cddcreq \
  CONFIG.CLKFB_IN_N_PORT clkfb_in_n \
  CONFIG.CLKFB_IN_PORT clkfb_in \
  CONFIG.CLKFB_IN_P_PORT clkfb_in_p \
  CONFIG.CLKFB_IN_SIGNALING SINGLE \
  CONFIG.CLKFB_OUT_N_PORT clkfb_out_n \
  CONFIG.CLKFB_OUT_PORT clkfb_out \
  CONFIG.CLKFB_OUT_P_PORT clkfb_out_p \
  CONFIG.CLKFB_STOPPED_PORT clkfb_stopped \
  CONFIG.CLKIN1_JITTER_PS 100.01 \
  CONFIG.CLKIN1_UI_JITTER 0.010 \
  CONFIG.CLKIN2_JITTER_PS 100.0 \
  CONFIG.CLKIN2_UI_JITTER 0.010 \
  CONFIG.CLKOUT1_DRIVES Buffer \
  CONFIG.CLKOUT1_JITTER 83.768 \
  CONFIG.CLKOUT1_MATCHED_ROUTING true \
  CONFIG.CLKOUT1_PHASE_ERROR 87.180 \
  CONFIG.CLKOUT1_REQUESTED_DUTY_CYCLE 50.000 \
  CONFIG.CLKOUT1_REQUESTED_OUT_FREQ 600 \
  CONFIG.CLKOUT1_REQUESTED_PHASE 0.000 \
  CONFIG.CLKOUT1_SEQUENCE_NUMBER 1 \
  CONFIG.CLKOUT1_USED true \
  CONFIG.CLKOUT2_DRIVES Buffer \
  CONFIG.CLKOUT2_JITTER 94.862 \
  CONFIG.CLKOUT2_MATCHED_ROUTING true \
  CONFIG.CLKOUT2_PHASE_ERROR 87.180 \
  CONFIG.CLKOUT2_REQUESTED_DUTY_CYCLE 50.000 \
  CONFIG.CLKOUT2_REQUESTED_OUT_FREQ 300 \
  CONFIG.CLKOUT2_REQUESTED_PHASE 0.000 \
  CONFIG.CLKOUT2_SEQUENCE_NUMBER 1 \
  CONFIG.CLKOUT2_USED true \
  CONFIG.CLKOUT3_DRIVES Buffer \
  CONFIG.CLKOUT3_JITTER 94.862 \
  CONFIG.CLKOUT3_MATCHED_ROUTING false \
  CONFIG.CLKOUT3_PHASE_ERROR 87.180 \
  CONFIG.CLKOUT3_REQUESTED_DUTY_CYCLE 50.000 \
  CONFIG.CLKOUT3_REQUESTED_OUT_FREQ 300 \
  CONFIG.CLKOUT3_REQUESTED_PHASE 0.000 \
  CONFIG.CLKOUT3_SEQUENCE_NUMBER 1 \
  CONFIG.CLKOUT3_USED true \
  CONFIG.CLKOUT4_DRIVES Buffer \
  CONFIG.CLKOUT4_JITTER 107.567 \
  CONFIG.CLKOUT4_MATCHED_ROUTING false \
  CONFIG.CLKOUT4_PHASE_ERROR 87.180 \
  CONFIG.CLKOUT4_REQUESTED_DUTY_CYCLE 50.000 \
  CONFIG.CLKOUT4_REQUESTED_OUT_FREQ 150 \
  CONFIG.CLKOUT4_REQUESTED_PHASE 0.000 \
  CONFIG.CLKOUT4_SEQUENCE_NUMBER 1 \
  CONFIG.CLKOUT4_USED true \
  CONFIG.CLKOUT5_DRIVES Buffer \
  CONFIG.CLKOUT5_JITTER 115.831 \
  CONFIG.CLKOUT5_MATCHED_ROUTING false \
  CONFIG.CLKOUT5_PHASE_ERROR 87.180 \
  CONFIG.CLKOUT5_REQUESTED_DUTY_CYCLE 50.000 \
  CONFIG.CLKOUT5_REQUESTED_OUT_FREQ 100 \
  CONFIG.CLKOUT5_REQUESTED_PHASE 0.000 \
  CONFIG.CLKOUT5_SEQUENCE_NUMBER 1 \
  CONFIG.CLKOUT5_USED true \
  CONFIG.CLKOUT6_DRIVES Buffer \
  CONFIG.CLKOUT6_JITTER 122.158 \
  CONFIG.CLKOUT6_MATCHED_ROUTING false \
  CONFIG.CLKOUT6_PHASE_ERROR 87.180 \
  CONFIG.CLKOUT6_REQUESTED_DUTY_CYCLE 50.000 \
  CONFIG.CLKOUT6_REQUESTED_OUT_FREQ 75 \
  CONFIG.CLKOUT6_REQUESTED_PHASE 0.000 \
  CONFIG.CLKOUT6_SEQUENCE_NUMBER 1 \
  CONFIG.CLKOUT6_USED true \
  CONFIG.CLKOUT7_DRIVES Buffer \
  CONFIG.CLKOUT7_JITTER 132.683 \
  CONFIG.CLKOUT7_MATCHED_ROUTING false \
  CONFIG.CLKOUT7_PHASE_ERROR 87.180 \
  CONFIG.CLKOUT7_REQUESTED_DUTY_CYCLE 50.000 \
  CONFIG.CLKOUT7_REQUESTED_OUT_FREQ 50 \
  CONFIG.CLKOUT7_REQUESTED_PHASE 0.000 \
  CONFIG.CLKOUT7_SEQUENCE_NUMBER 1 \
  CONFIG.CLKOUT7_USED true \
  CONFIG.CLKOUTPHY_REQUESTED_FREQ 600.000 \
  CONFIG.CLK_IN1_BOARD_INTERFACE Custom \
  CONFIG.CLK_IN2_BOARD_INTERFACE Custom \
  CONFIG.CLK_IN_SEL_PORT clk_in_sel \
  CONFIG.CLK_OUT1_PORT clk_dpu_600 \
  CONFIG.CLK_OUT1_USE_FINE_PS_GUI false \
  CONFIG.CLK_OUT2_PORT clk_dpu_300 \
  CONFIG.CLK_OUT2_USE_FINE_PS_GUI false \
  CONFIG.CLK_OUT3_PORT clk_video \
  CONFIG.CLK_OUT3_USE_FINE_PS_GUI false \
  CONFIG.CLK_OUT4_PORT clk_150 \
  CONFIG.CLK_OUT4_USE_FINE_PS_GUI false \
  CONFIG.CLK_OUT5_PORT clk_100 \
  CONFIG.CLK_OUT5_USE_FINE_PS_GUI false \
  CONFIG.CLK_OUT6_PORT clk_75 \
  CONFIG.CLK_OUT6_USE_FINE_PS_GUI false \
  CONFIG.CLK_OUT7_PORT clk_50 \
  CONFIG.CLK_OUT7_USE_FINE_PS_GUI false \
  CONFIG.CLK_VALID_PORT CLK_VALID \
  CONFIG.CLOCK_MGR_TYPE auto \
  CONFIG.DADDR_PORT daddr \
  CONFIG.DCLK_PORT dclk \
  CONFIG.DEN_PORT den \
  CONFIG.DIFF_CLK_IN1_BOARD_INTERFACE Custom \
  CONFIG.DIFF_CLK_IN2_BOARD_INTERFACE Custom \
  CONFIG.DIN_PORT din \
  CONFIG.DOUT_PORT dout \
  CONFIG.DRDY_PORT drdy \
  CONFIG.DWE_PORT dwe \
  CONFIG.ENABLE_CDDC false \
  CONFIG.ENABLE_CLKOUTPHY false \
  CONFIG.ENABLE_CLOCK_MONITOR false \
  CONFIG.ENABLE_USER_CLOCK0 false \
  CONFIG.ENABLE_USER_CLOCK1 false \
  CONFIG.ENABLE_USER_CLOCK2 false \
  CONFIG.ENABLE_USER_CLOCK3 false \
  CONFIG.Enable_PLL0 false \
  CONFIG.Enable_PLL1 false \
  CONFIG.FEEDBACK_SOURCE FDBK_AUTO \
  CONFIG.INPUT_CLK_STOPPED_PORT input_clk_stopped \
  CONFIG.INPUT_MODE frequency \
  CONFIG.INTERFACE_SELECTION Enable_AXI \
  CONFIG.IN_FREQ_UNITS Units_MHz \
  CONFIG.IN_JITTER_UNITS Units_UI \
  CONFIG.JITTER_OPTIONS UI \
  CONFIG.JITTER_SEL No_Jitter \
  CONFIG.LOCKED_PORT locked \
  CONFIG.MMCM_BANDWIDTH OPTIMIZED \
  CONFIG.MMCM_CLKFBOUT_MULT_F 12.000 \
  CONFIG.MMCM_CLKFBOUT_PHASE 0.000 \
  CONFIG.MMCM_CLKFBOUT_USE_FINE_PS false \
  CONFIG.MMCM_CLKIN1_PERIOD 10.000 \
  CONFIG.MMCM_CLKIN2_PERIOD 10.000 \
  CONFIG.MMCM_CLKOUT0_DIVIDE_F 2.000 \
  CONFIG.MMCM_CLKOUT0_DUTY_CYCLE 0.500 \
  CONFIG.MMCM_CLKOUT0_PHASE 0.000 \
  CONFIG.MMCM_CLKOUT0_USE_FINE_PS false \
  CONFIG.MMCM_CLKOUT1_DIVIDE 4 \
  CONFIG.MMCM_CLKOUT1_DUTY_CYCLE 0.500 \
  CONFIG.MMCM_CLKOUT1_PHASE 0.000 \
  CONFIG.MMCM_CLKOUT1_USE_FINE_PS false \
  CONFIG.MMCM_CLKOUT2_DIVIDE 4 \
  CONFIG.MMCM_CLKOUT2_DUTY_CYCLE 0.500 \
  CONFIG.MMCM_CLKOUT2_PHASE 0.000 \
  CONFIG.MMCM_CLKOUT2_USE_FINE_PS false \
  CONFIG.MMCM_CLKOUT3_DIVIDE 8 \
  CONFIG.MMCM_CLKOUT3_DUTY_CYCLE 0.500 \
  CONFIG.MMCM_CLKOUT3_PHASE 0.000 \
  CONFIG.MMCM_CLKOUT3_USE_FINE_PS false \
  CONFIG.MMCM_CLKOUT4_CASCADE false \
  CONFIG.MMCM_CLKOUT4_DIVIDE 12 \
  CONFIG.MMCM_CLKOUT4_DUTY_CYCLE 0.500 \
  CONFIG.MMCM_CLKOUT4_PHASE 0.000 \
  CONFIG.MMCM_CLKOUT4_USE_FINE_PS false \
  CONFIG.MMCM_CLKOUT5_DIVIDE 16 \
  CONFIG.MMCM_CLKOUT5_DUTY_CYCLE 0.500 \
  CONFIG.MMCM_CLKOUT5_PHASE 0.000 \
  CONFIG.MMCM_CLKOUT5_USE_FINE_PS false \
  CONFIG.MMCM_CLKOUT6_DIVIDE 24 \
  CONFIG.MMCM_CLKOUT6_DUTY_CYCLE 0.500 \
  CONFIG.MMCM_CLKOUT6_PHASE 0.000 \
  CONFIG.MMCM_CLKOUT6_USE_FINE_PS false \
  CONFIG.MMCM_CLOCK_HOLD false \
  CONFIG.MMCM_COMPENSATION AUTO \
  CONFIG.MMCM_DIVCLK_DIVIDE 1 \
  CONFIG.MMCM_NOTES None \
  CONFIG.MMCM_REF_JITTER1 0.010 \
  CONFIG.MMCM_REF_JITTER2 0.010 \
  CONFIG.MMCM_STARTUP_WAIT false \
  CONFIG.NUM_OUT_CLKS 7 \
  CONFIG.OPTIMIZE_CLOCKING_STRUCTURE_EN false \
  CONFIG.OVERRIDE_MMCM false \
  CONFIG.OVERRIDE_PLL false \
  CONFIG.PHASESHIFT_MODE LATENCY \
  CONFIG.PHASE_DUTY_CONFIG false \
  CONFIG.PLATFORM UNKNOWN \
  CONFIG.PLL_BANDWIDTH OPTIMIZED \
  CONFIG.PLL_CLKFBOUT_MULT 4 \
  CONFIG.PLL_CLKFBOUT_PHASE 0.000 \
  CONFIG.PLL_CLKIN_PERIOD 10.000 \
  CONFIG.PLL_CLKOUT0_DIVIDE 1 \
  CONFIG.PLL_CLKOUT0_DUTY_CYCLE 0.500 \
  CONFIG.PLL_CLKOUT0_PHASE 0.000 \
  CONFIG.PLL_CLKOUT1_DIVIDE 1 \
  CONFIG.PLL_CLKOUT1_DUTY_CYCLE 0.500 \
  CONFIG.PLL_CLKOUT1_PHASE 0.000 \
  CONFIG.PLL_CLKOUT2_DIVIDE 1 \
  CONFIG.PLL_CLKOUT2_DUTY_CYCLE 0.500 \
  CONFIG.PLL_CLKOUT2_PHASE 0.000 \
  CONFIG.PLL_CLKOUT3_DIVIDE 1 \
  CONFIG.PLL_CLKOUT3_DUTY_CYCLE 0.500 \
  CONFIG.PLL_CLKOUT3_PHASE 0.000 \
  CONFIG.PLL_CLKOUT4_DIVIDE 1 \
  CONFIG.PLL_CLKOUT4_DUTY_CYCLE 0.500 \
  CONFIG.PLL_CLKOUT4_PHASE 0.000 \
  CONFIG.PLL_CLKOUT5_DIVIDE 1 \
  CONFIG.PLL_CLKOUT5_DUTY_CYCLE 0.500 \
  CONFIG.PLL_CLKOUT5_PHASE 0.000 \
  CONFIG.PLL_CLK_FEEDBACK CLKFBOUT \
  CONFIG.PLL_COMPENSATION SYSTEM_SYNCHRONOUS \
  CONFIG.PLL_DIVCLK_DIVIDE 1 \
  CONFIG.PLL_NOTES None \
  CONFIG.PLL_REF_JITTER 0.010 \
  CONFIG.POWER_DOWN_PORT power_down \
  CONFIG.PRECISION 1 \
  CONFIG.PRIMARY_PORT clk_in1 \
  CONFIG.PRIMITIVE MMCM \
  CONFIG.PRIMTYPE_SEL mmcm_adv \
  CONFIG.PRIM_IN_FREQ 100.000 \
  CONFIG.PRIM_IN_JITTER 0.010 \
  CONFIG.PRIM_IN_TIMEPERIOD 10.000 \
  CONFIG.PRIM_SOURCE Single_ended_clock_capable_pin \
  CONFIG.PSCLK_PORT psclk \
  CONFIG.PSDONE_PORT psdone \
  CONFIG.PSEN_PORT psen \
  CONFIG.PSINCDEC_PORT psincdec \
  CONFIG.REF_CLK_FREQ 100.0 \
  CONFIG.RELATIVE_INCLK REL_PRIMARY \
  CONFIG.RESET_BOARD_INTERFACE Custom \
  CONFIG.RESET_PORT resetn \
  CONFIG.RESET_TYPE ACTIVE_LOW \
  CONFIG.SECONDARY_IN_FREQ 100.000 \
  CONFIG.SECONDARY_IN_JITTER 0.010 \
  CONFIG.SECONDARY_IN_TIMEPERIOD 10.000 \
  CONFIG.SECONDARY_PORT clk_in2 \
  CONFIG.SECONDARY_SOURCE Single_ended_clock_capable_pin \
  CONFIG.SS_MODE CENTER_HIGH \
  CONFIG.SS_MOD_FREQ 250 \
  CONFIG.SS_MOD_TIME 0.004 \
  CONFIG.STATUS_PORT STATUS \
  CONFIG.SUMMARY_STRINGS empty \
  CONFIG.USER_CLK_FREQ0 100.0 \
  CONFIG.USER_CLK_FREQ1 100.0 \
  CONFIG.USER_CLK_FREQ2 100.0 \
  CONFIG.USER_CLK_FREQ3 100.0 \
  CONFIG.USE_BOARD_FLOW false \
  CONFIG.USE_CLKFB_STOPPED false \
  CONFIG.USE_CLK_VALID false \
  CONFIG.USE_CLOCK_SEQUENCING false \
  CONFIG.USE_DYN_PHASE_SHIFT false \
  CONFIG.USE_DYN_RECONFIG false \
  CONFIG.USE_FREEZE false \
  CONFIG.USE_FREQ_SYNTH true \
  CONFIG.USE_INCLK_STOPPED false \
  CONFIG.USE_INCLK_SWITCHOVER false \
  CONFIG.USE_LOCKED true \
  CONFIG.USE_MAX_I_JITTER false \
  CONFIG.USE_MIN_O_JITTER false \
  CONFIG.USE_MIN_POWER false \
  CONFIG.USE_PHASE_ALIGNMENT false \
  CONFIG.USE_POWER_DOWN false \
  CONFIG.USE_RESET true \
  CONFIG.USE_SAFE_CLOCK_STARTUP false \
  CONFIG.USE_SPREAD_SPECTRUM false \
  CONFIG.USE_STATUS false \
] [get_bd_cells clk_wiz]
create_bd_cell -type ip -vlnv xilinx.com:ip:proc_sys_reset:5.0 reset_50

# ---- connections ----

current_bd_instance /img_proc
connect_bd_intf_net [get_bd_intf_pins M_AXI_MM2S] [get_bd_intf_pins histeq_vdma/M_AXI_MM2S]
connect_bd_intf_net [get_bd_intf_pins M_AXI_S2MM] [get_bd_intf_pins histeq_vdma/M_AXI_S2MM]
connect_bd_intf_net [get_bd_intf_pins S_AXI] [get_bd_intf_pins histeq_control_gpio/S_AXI]
connect_bd_intf_net [get_bd_intf_pins S_AXI_LITE] [get_bd_intf_pins histeq_vdma/S_AXI_LITE]
connect_bd_net -net M02_ARESETN_1 [get_bd_pins S00_ARESETN] [get_bd_pins histeq_control_gpio/s_axi_aresetn] [get_bd_pins histeq_vdma/axi_resetn]
connect_bd_net [get_bd_pins slowest_sync_clk] \
  [get_bd_pins histeq_vdma/m_axis_mm2s_aclk] [get_bd_pins histeq_vdma/s_axis_s2mm_aclk] \
  [get_bd_pins proc_sys_reset_7/slowest_sync_clk]
connect_bd_net -net axi_gpio_0_gpio_io_o [get_bd_pins histeq_control_gpio/gpio_io_o] \
  [get_bd_pins rows_split/Din] [get_bd_pins cols_split/Din] [get_bd_pins reset_split/Din]
connect_bd_net -net axi_vdma_0_mm2s_introut [get_bd_pins histeq_vdma/mm2s_introut] [get_bd_pins mm2s_introut]
connect_bd_net -net axi_vdma_0_s2mm_introut [get_bd_pins histeq_vdma/s2mm_introut] [get_bd_pins s2mm_introut]
connect_bd_net -net clk_wiz_0_clk_out1 [get_bd_pins S01_ACLK] [get_bd_pins histeq_vdma/m_axi_s2mm_aclk] [get_bd_pins histeq_vdma/m_axi_mm2s_aclk]
connect_bd_net [get_bd_pins dcm_locked] [get_bd_pins proc_sys_reset_7/dcm_locked]
connect_bd_net [get_bd_pins ext_reset_in] [get_bd_pins proc_sys_reset_7/ext_reset_in]
connect_bd_net [get_bd_pins reset_split/Dout] [get_bd_pins proc_sys_reset_7/aux_reset_in]
connect_bd_net [get_bd_pins s_axi_aclk] [get_bd_pins histeq_control_gpio/s_axi_aclk] [get_bd_pins histeq_vdma/s_axi_lite_aclk]

current_bd_instance /video
connect_bd_intf_net [get_bd_intf_pins s_axi_control] [get_bd_intf_pins hdmi_out/s_axi_control]
connect_bd_intf_net [get_bd_intf_pins s_axi_control1] [get_bd_intf_pins hdmi_in/s_axi_control]
connect_bd_intf_net [get_bd_intf_pins s_axi_control2] [get_bd_intf_pins hdmi_in/s_axi_control1]
connect_bd_intf_net [get_bd_intf_pins s_axi_control3] [get_bd_intf_pins hdmi_out/s_axi_control1]
connect_bd_intf_net [get_bd_intf_pins axi_vdma/M_AXIS_MM2S] [get_bd_intf_pins hdmi_out/stream_in_64]
connect_bd_intf_net [get_bd_intf_pins M_AXI_MM2S] [get_bd_intf_pins axi_vdma/M_AXI_MM2S]
connect_bd_intf_net [get_bd_intf_pins M_AXI_S2MM] [get_bd_intf_pins axi_vdma/M_AXI_S2MM]
connect_bd_intf_net [get_bd_intf_pins DRU_CLK_IN] [get_bd_intf_pins phy/DRU_CLK_IN]
connect_bd_intf_net [get_bd_intf_pins RX_DDC_OUT] [get_bd_intf_pins hdmi_in/RX_DDC_OUT]
connect_bd_intf_net [get_bd_intf_pins TX_DDC_OUT] [get_bd_intf_pins hdmi_out/TX_DDC_OUT]
connect_bd_intf_net [get_bd_intf_pins hdmi_out/LINK_DATA0_OUT] [get_bd_intf_pins phy/vid_phy_tx_axi4s_ch0]
connect_bd_intf_net [get_bd_intf_pins hdmi_out/LINK_DATA1_OUT] [get_bd_intf_pins phy/vid_phy_tx_axi4s_ch1]
connect_bd_intf_net [get_bd_intf_pins hdmi_out/LINK_DATA2_OUT] [get_bd_intf_pins phy/vid_phy_tx_axi4s_ch2]
connect_bd_intf_net [get_bd_intf_pins hdmi_in/LINK_DATA0_IN] [get_bd_intf_pins phy/vid_phy_rx_axi4s_ch0]
connect_bd_intf_net [get_bd_intf_pins hdmi_in/LINK_DATA1_IN] [get_bd_intf_pins phy/vid_phy_rx_axi4s_ch1]
connect_bd_intf_net [get_bd_intf_pins hdmi_in/LINK_DATA2_IN] [get_bd_intf_pins phy/vid_phy_rx_axi4s_ch2]
connect_bd_intf_net [get_bd_intf_pins hdmi_in/SB_STATUS_IN] [get_bd_intf_pins phy/vid_phy_status_sb_rx]
connect_bd_intf_net [get_bd_intf_pins hdmi_out/SB_STATUS_IN] [get_bd_intf_pins phy/vid_phy_status_sb_tx]
connect_bd_intf_net [get_bd_intf_pins vid_phy_axi4lite] [get_bd_intf_pins phy/vid_phy_axi4lite]
connect_bd_intf_net [get_bd_intf_pins S_AXI_CPU_IN] [get_bd_intf_pins hdmi_in/S_AXI_CPU_IN]
connect_bd_intf_net [get_bd_intf_pins S_AXI_CPU_IN1] [get_bd_intf_pins hdmi_out/S_AXI_CPU_IN]
connect_bd_intf_net [get_bd_intf_pins axi_vdma/S_AXIS_S2MM] [get_bd_intf_pins hdmi_in/stream_out_64]
connect_bd_intf_net [get_bd_intf_pins S_AXI_LITE] [get_bd_intf_pins axi_vdma/S_AXI_LITE]
connect_bd_net -net axi_vdma_0_mm2s_introut [get_bd_pins axi_vdma/mm2s_introut] [get_bd_pins mm2s_introut]
connect_bd_net -net axi_vdma_0_s2mm_introut [get_bd_pins axi_vdma/s2mm_introut] [get_bd_pins s2mm_introut]
connect_bd_net [get_bd_pins const_gnd/dout] \
  [get_bd_pins hdmi_in/s_axis_audio_aclk] [get_bd_pins hdmi_in/s_axis_audio_aresetn] [get_bd_pins hdmi_out/acr_valid] \
  [get_bd_pins hdmi_out/s_axis_audio_aclk] [get_bd_pins hdmi_out/s_axis_audio_aresetn]
connect_bd_net -net net_bdry_in_HDMI_RX_CLK_N_IN [get_bd_pins HDMI_RX_CLK_N_IN] [get_bd_pins phy/HDMI_RX_CLK_N_IN]
connect_bd_net -net net_bdry_in_HDMI_RX_CLK_P_IN [get_bd_pins HDMI_RX_CLK_P_IN] [get_bd_pins phy/HDMI_RX_CLK_P_IN]
connect_bd_net -net net_bdry_in_HDMI_RX_DAT_N_IN [get_bd_pins HDMI_RX_DAT_N_IN] [get_bd_pins phy/HDMI_RX_DAT_N_IN]
connect_bd_net -net net_bdry_in_HDMI_RX_DAT_P_IN [get_bd_pins HDMI_RX_DAT_P_IN] [get_bd_pins phy/HDMI_RX_DAT_P_IN]
connect_bd_net -net net_bdry_in_IDT_8T49N241_LOL_IN [get_bd_pins IDT_8T49N241_LOL_IN] [get_bd_pins phy/IDT_8T49N241_LOL_IN]
connect_bd_net -net net_bdry_in_RX_DET_IN [get_bd_pins RX_DET_IN] [get_bd_pins hdmi_in/RX_DET_IN]
connect_bd_net -net net_bdry_in_TX_HPD_IN [get_bd_pins TX_HPD_IN] [get_bd_pins hdmi_out/TX_HPD_IN]
connect_bd_net -net net_bdry_in_TX_REFCLK_N_IN [get_bd_pins TX_REFCLK_N_IN] [get_bd_pins phy/TX_REFCLK_N_IN]
connect_bd_net -net net_bdry_in_TX_REFCLK_P_IN [get_bd_pins TX_REFCLK_P_IN] [get_bd_pins phy/TX_REFCLK_P_IN]
connect_bd_net -net net_v_hdmi_rx_ss_hpd [get_bd_pins hdmi_in/RX_HPD_OUT] [get_bd_pins RX_HPD_OUT]
connect_bd_net -net net_v_hdmi_rx_ss_irq [get_bd_pins hdmi_in/irq] [get_bd_pins irq]
connect_bd_net -net net_v_hdmi_tx_ss_irq [get_bd_pins hdmi_out/irq1] [get_bd_pins irq1]
connect_bd_net -net net_vcc_const_dout [get_bd_pins TX_EN_OUT] [get_bd_pins phy/TX_EN_OUT]
connect_bd_net -net net_vid_phy_controller_irq [get_bd_pins phy/irq2] [get_bd_pins irq2]
connect_bd_net -net net_vid_phy_controller_phy_txn_out [get_bd_pins phy/HDMI_TX_DAT_N_OUT] [get_bd_pins HDMI_TX_DAT_N_OUT]
connect_bd_net -net net_vid_phy_controller_phy_txp_out [get_bd_pins phy/HDMI_TX_DAT_P_OUT] [get_bd_pins HDMI_TX_DAT_P_OUT]
connect_bd_net -net net_vid_phy_controller_rx_tmds_clk_n [get_bd_pins phy/RX_REFCLK_N_OUT] [get_bd_pins RX_REFCLK_N_OUT]
connect_bd_net -net net_vid_phy_controller_rx_tmds_clk_p [get_bd_pins phy/RX_REFCLK_P_OUT] [get_bd_pins RX_REFCLK_P_OUT]
connect_bd_net -net net_vid_phy_controller_rx_video_clk [get_bd_pins phy/rx_video_clk] [get_bd_pins hdmi_in/video_clk]
connect_bd_net -net net_vid_phy_controller_rxoutclk [get_bd_pins phy/vid_phy_rx_axi4s_aclk] [get_bd_pins hdmi_in/link_clk]
connect_bd_net -net net_vid_phy_controller_tx_tmds_clk_n [get_bd_pins phy/HDMI_TX_CLK_N_OUT] [get_bd_pins HDMI_TX_CLK_N_OUT]
connect_bd_net -net net_vid_phy_controller_tx_tmds_clk_p [get_bd_pins phy/HDMI_TX_CLK_P_OUT] [get_bd_pins HDMI_TX_CLK_P_OUT]
connect_bd_net -net net_vid_phy_controller_tx_video_clk [get_bd_pins phy/tx_video_clk] [get_bd_pins hdmi_out/video_clk]
connect_bd_net -net net_vid_phy_controller_txoutclk [get_bd_pins phy/vid_phy_tx_axi4s_aclk] [get_bd_pins hdmi_out/link_clk]
connect_bd_net -net net_zynq_us_ss_0_clk_out2 [get_bd_pins aclk] \
  [get_bd_pins axi_vdma/m_axi_mm2s_aclk] [get_bd_pins axi_vdma/m_axi_s2mm_aclk] [get_bd_pins axi_vdma/m_axis_mm2s_aclk] \
  [get_bd_pins axi_vdma/s_axis_s2mm_aclk] [get_bd_pins hdmi_in/aclk] [get_bd_pins hdmi_out/aclk]
connect_bd_net -net net_zynq_us_ss_0_dcm_locked [get_bd_pins aresetn] [get_bd_pins hdmi_in/aresetn] [get_bd_pins hdmi_out/aresetn]
connect_bd_net -net net_zynq_us_ss_0_peripheral_aresetn [get_bd_pins s_axi_cpu_aresetn] \
  [get_bd_pins axi_vdma/axi_resetn] [get_bd_pins hdmi_in/s_axi_cpu_aresetn] [get_bd_pins hdmi_out/s_axi_cpu_aresetn] \
  [get_bd_pins phy/s_axi_cpu_aresetn]
connect_bd_net -net net_zynq_us_ss_0_s_axi_aclk [get_bd_pins s_axi_cpu_aclk] \
  [get_bd_pins axi_vdma/s_axi_lite_aclk] [get_bd_pins hdmi_in/s_axi_cpu_aclk] [get_bd_pins hdmi_out/s_axi_cpu_aclk] \
  [get_bd_pins phy/s_axi_cpu_aclk]
